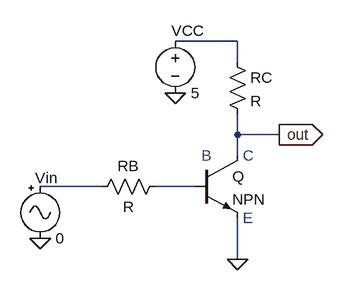
[diagram p0: schematic inverter.asc]
inverter.asc, the LTspice schematic file:
Version 4.1
SHEET 1 880 680
WIRE 272 -64 176 -64
WIRE 272 -32 272 -64
WIRE 272 80 272 48
WIRE 336 80 272 80
WIRE 272 112 272 80
WIRE 64 160 -32 160
WIRE 208 160 144 160
WIRE 272 272 272 208
FLAG 272 272 0
FLAG 336 80 out
IOPIN 336 80 Out
FLAG 176 16 0
FLAG -32 240 0
SYMBOL res 160 144 R90
WINDOW 0 0 56 VBottom 2
WINDOW 3 32 56 VTop 2
SYMATTR InstName RB
SYMBOL npn 208 112 R0
SYMATTR InstName Q
SYMBOL res 256 -48 R0
SYMATTR InstName RC
SYMBOL voltage 176 -80 R0
WINDOW 0 -6 0 Left 2
SYMATTR InstName VCC
SYMATTR Value 5
SYMBOL Misc\\signal -32 144 R0
WINDOW 0 -8 3 Left 2
SYMATTR InstName Vin
SYMATTR Value 0
TEXT 280 112 Left 2 ;C
TEXT 280 208 Left 2 ;E
TEXT 216 112 Left 2 ;B

The netlist it stands for:
* inverter.asc
RB N003 N002 R
Q out N003 0 0 NPN
RC N001 out R
VCC N001 0 5
Vin N002 0 0
.model NPN NPN
.model PNP PNP
.lib standard.bjt
* C
* E
* B
.backanno
.end